# Altium schematic sheet AllPins_Peripherals.SchDoc
size A4; SheetNumber: 8; SheetTotal: 10
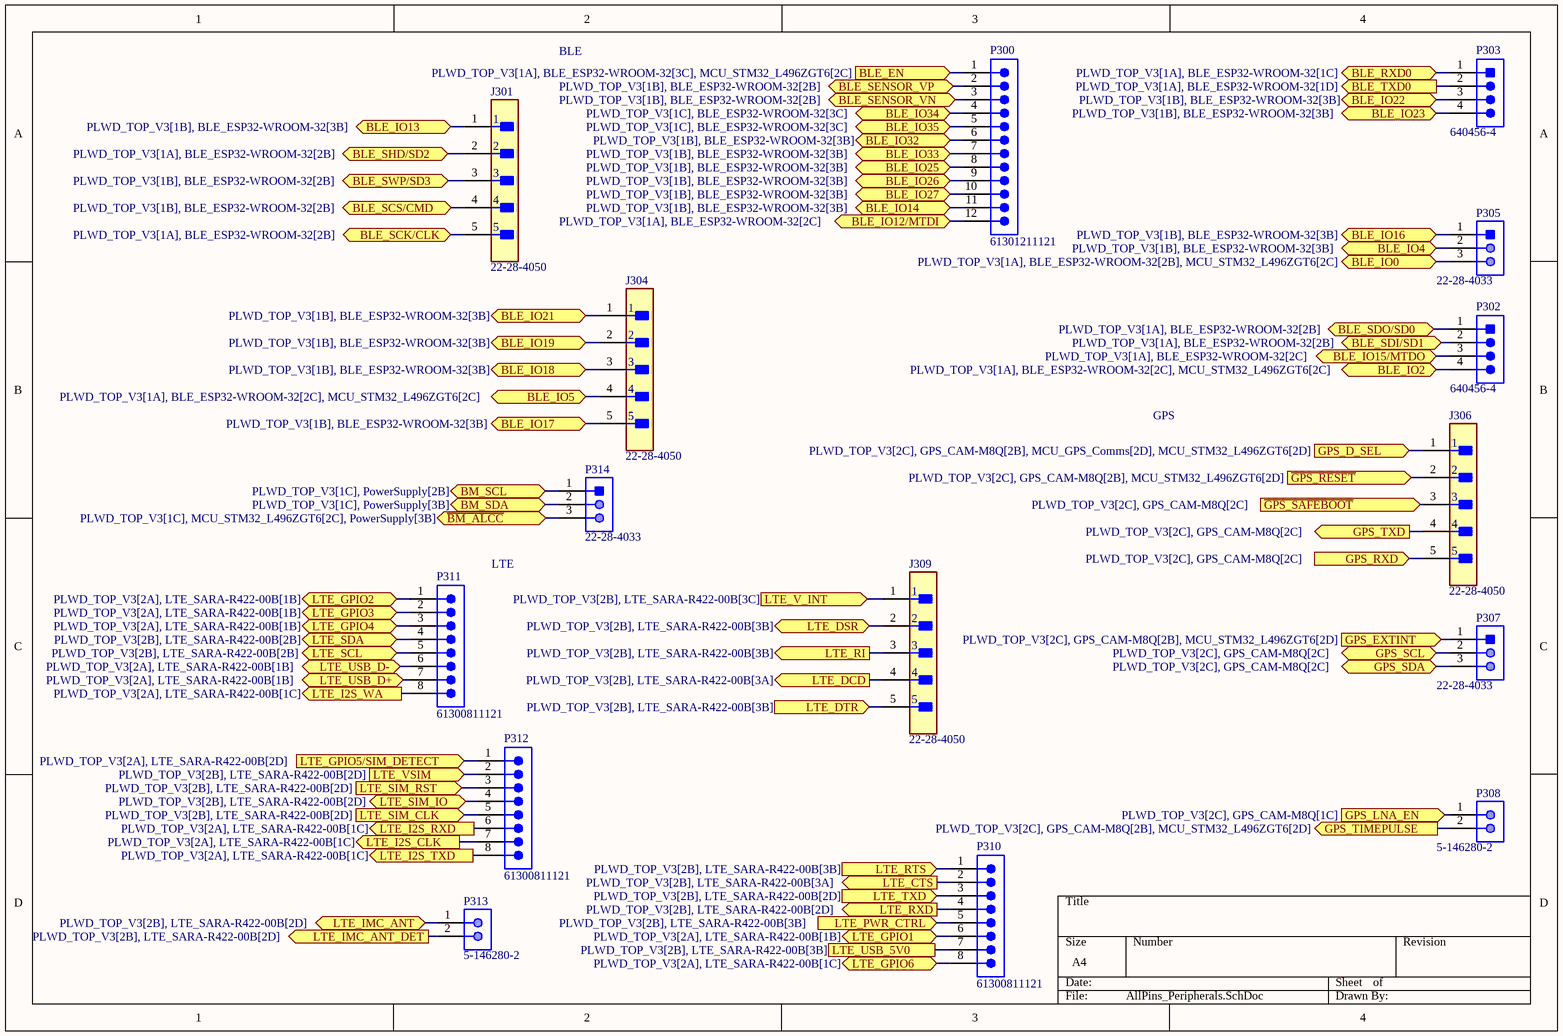
[diagram p0: AllPins_Peripherals.SchDoc]

## Parts
J301  22-28-4050  [FP-22-28-4050-MFG]
J304  22-28-4050  [FP-22-28-4050-MFG]
J306  22-28-4050  [FP-22-28-4050-MFG]
J309  22-28-4050  [FP-22-28-4050-MFG]
P300  61301211121  [61301211121]
P302  640456-4  [TECO-640456-4]
P303  640456-4  [TECO-640456-4]
P305  22-28-4033  [MOLX-22-28-4033_V]
P307  22-28-4033  [MOLX-22-28-4033_V]
P308  5-146280-2  [TECO-5-146280-2_V]
P310  61300811121  [61300811121]
P311  61300811121  [61300811121]
P312  61300811121  [61300811121]
P313  5-146280-2  [TECO-5-146280-2_V]
P314  22-28-4033  [MOLX-22-28-4033_V]

## Ports
BLE_EN (in, see PLWD_TOP_V3[1A], BLE_ESP32-WROOM-32[3C], MCU_STM32_L496ZGT6[2C]), BLE_IO0 (bidir, see PLWD_TOP_V3[1A], BLE_ESP32-WROOM-32[2B], MCU_STM32_L496ZGT6[2C]), BLE_IO2 (bidir, see PLWD_TOP_V3[1A], BLE_ESP32-WROOM-32[2C], MCU_STM32_L496ZGT6[2C]), BLE_IO4 (bidir, see PLWD_TOP_V3[1B], BLE_ESP32-WROOM-32[3B]), BLE_IO5 (bidir, see PLWD_TOP_V3[1A], BLE_ESP32-WROOM-32[2C], MCU_STM32_L496ZGT6[2C]), BLE_IO12/MTDI (bidir, see PLWD_TOP_V3[1A], BLE_ESP32-WROOM-32[2C]), BLE_IO13 (bidir, see PLWD_TOP_V3[1B], BLE_ESP32-WROOM-32[3B]), BLE_IO14 (bidir, see PLWD_TOP_V3[1B], BLE_ESP32-WROOM-32[3B]), BLE_IO15/MTDO (bidir, see PLWD_TOP_V3[1A], BLE_ESP32-WROOM-32[2C]), BLE_IO16 (bidir, see PLWD_TOP_V3[1B], BLE_ESP32-WROOM-32[3B]), BLE_IO17 (bidir, see PLWD_TOP_V3[1B], BLE_ESP32-WROOM-32[3B]), BLE_IO18 (bidir, see PLWD_TOP_V3[1B], BLE_ESP32-WROOM-32[3B]), BLE_IO19 (bidir, see PLWD_TOP_V3[1B], BLE_ESP32-WROOM-32[3B]), BLE_IO21 (bidir, see PLWD_TOP_V3[1B], BLE_ESP32-WROOM-32[3B]), BLE_IO22 (bidir, see PLWD_TOP_V3[1B], BLE_ESP32-WROOM-32[3B]), BLE_IO23 (bidir, see PLWD_TOP_V3[1B], BLE_ESP32-WROOM-32[3B]), BLE_IO25 (bidir, see PLWD_TOP_V3[1B], BLE_ESP32-WROOM-32[3B]), BLE_IO26 (bidir, see PLWD_TOP_V3[1B], BLE_ESP32-WROOM-32[3B]), BLE_IO27 (bidir, see PLWD_TOP_V3[1B], BLE_ESP32-WROOM-32[3B]), BLE_IO32 (bidir, see PLWD_TOP_V3[1B], BLE_ESP32-WROOM-32[3B]), BLE_IO33 (bidir, see PLWD_TOP_V3[1B], BLE_ESP32-WROOM-32[3B]), BLE_IO34 (bidir, see PLWD_TOP_V3[1C], BLE_ESP32-WROOM-32[3C]), BLE_IO35 (bidir, see PLWD_TOP_V3[1C], BLE_ESP32-WROOM-32[3C]), BLE_RXD0 (bidir, see PLWD_TOP_V3[1A], BLE_ESP32-WROOM-32[1C]), BLE_SCK/CLK (bidir, see PLWD_TOP_V3[1A], BLE_ESP32-WROOM-32[2B]), BLE_SCS/CMD (bidir, see PLWD_TOP_V3[1B], BLE_ESP32-WROOM-32[2B]), BLE_SDI/SD1 (bidir, see PLWD_TOP_V3[1A], BLE_ESP32-WROOM-32[2B]), BLE_SDO/SD0 (bidir, see PLWD_TOP_V3[1A], BLE_ESP32-WROOM-32[2B]), BLE_SENSOR_VN (bidir, see PLWD_TOP_V3[1B], BLE_ESP32-WROOM-32[2B]), BLE_SENSOR_VP (bidir, see PLWD_TOP_V3[1B], BLE_ESP32-WROOM-32[2B]), BLE_SHD/SD2 (bidir, see PLWD_TOP_V3[1A], BLE_ESP32-WROOM-32[2B]), BLE_SWP/SD3 (bidir, see PLWD_TOP_V3[1B], BLE_ESP32-WROOM-32[2B]), BLE_TXD0 (out, see PLWD_TOP_V3[1A], BLE_ESP32-WROOM-32[1D]), BM_SCL (bidir, see PLWD_TOP_V3[1C], PowerSupply[2B]), BM_SDA (bidir, see PLWD_TOP_V3[1C], PowerSupply[3B]), GPS_D_SEL (in, see PLWD_TOP_V3[2C], GPS_CAM-M8Q[2B], MCU_GPS_Comms[2D], MCU_STM32_L496ZGT6[2D]), GPS_EXTINT (in, see PLWD_TOP_V3[2C], GPS_CAM-M8Q[2B], MCU_STM32_L496ZGT6[2D]), GPS_LNA_EN (in, see PLWD_TOP_V3[2C], GPS_CAM-M8Q[1C]), GPS_RXD (in, see PLWD_TOP_V3[2C], GPS_CAM-M8Q[2C]), GPS_SCL (bidir, see PLWD_TOP_V3[2C], GPS_CAM-M8Q[2C]), GPS_SDA (bidir, see PLWD_TOP_V3[2C], GPS_CAM-M8Q[2C]), GPS_TIMEPULSE (out, see PLWD_TOP_V3[2C], GPS_CAM-M8Q[2B], MCU_STM32_L496ZGT6[2D]), GPS_TXD (out, see PLWD_TOP_V3[2C], GPS_CAM-M8Q[2C]), LTE_CTS (out, see PLWD_TOP_V3[2B], LTE_SARA-R422-00B[3A]), LTE_DCD (out, see PLWD_TOP_V3[2B], LTE_SARA-R422-00B[3A]), LTE_DSR (bidir, see PLWD_TOP_V3[2B], LTE_SARA-R422-00B[3B]), LTE_DTR (in, see PLWD_TOP_V3[2B], LTE_SARA-R422-00B[3B]), LTE_GPIO1 (bidir, see PLWD_TOP_V3[2A], LTE_SARA-R422-00B[1B]), LTE_GPIO2 (bidir, see PLWD_TOP_V3[2A], LTE_SARA-R422-00B[1B]), LTE_GPIO3 (bidir, see PLWD_TOP_V3[2A], LTE_SARA-R422-00B[1B]), LTE_GPIO4 (bidir, see PLWD_TOP_V3[2A], LTE_SARA-R422-00B[1B]), LTE_GPIO5/SIM_DETECT (in, see PLWD_TOP_V3[2A], LTE_SARA-R422-00B[2D]), LTE_GPIO6 (bidir, see PLWD_TOP_V3[2A], LTE_SARA-R422-00B[1C]), LTE_I2S_CLK (out, see PLWD_TOP_V3[2A], LTE_SARA-R422-00B[1C]), LTE_I2S_RXD (out, see PLWD_TOP_V3[2A], LTE_SARA-R422-00B[1C]), LTE_I2S_TXD (out, see PLWD_TOP_V3[2A], LTE_SARA-R422-00B[1C]), LTE_I2S_WA (out, see PLWD_TOP_V3[2A], LTE_SARA-R422-00B[1C]), LTE_IMC_ANT (bidir, see PLWD_TOP_V3[2B], LTE_SARA-R422-00B[2D]), LTE_IMC_ANT_DET (out, see PLWD_TOP_V3[2B], LTE_SARA-R422-00B[2D]), LTE_PWR_CTRL (in, see PLWD_TOP_V3[2B], LTE_SARA-R422-00B[3B]), LTE_RI (out, see PLWD_TOP_V3[2B], LTE_SARA-R422-00B[3B]), LTE_RTS (in, see PLWD_TOP_V3[2B], LTE_SARA-R422-00B[3B]), LTE_RXD (out, see PLWD_TOP_V3[2B], LTE_SARA-R422-00B[2D]), LTE_SCL (bidir, see PLWD_TOP_V3[2B], LTE_SARA-R422-00B[2B]), LTE_SDA (bidir, see PLWD_TOP_V3[2B], LTE_SARA-R422-00B[2B]), LTE_SIM_CLK (in, see PLWD_TOP_V3[2B], LTE_SARA-R422-00B[2D]), LTE_SIM_IO (bidir, see PLWD_TOP_V3[2B], LTE_SARA-R422-00B[2D]), LTE_SIM_RST (in, see PLWD_TOP_V3[2B], LTE_SARA-R422-00B[2D]), LTE_TXD (in, see PLWD_TOP_V3[2B], LTE_SARA-R422-00B[2D]), LTE_USB_5V0 (see PLWD_TOP_V3[2B], LTE_SARA-R422-00B[3B]), LTE_USB_D+ (bidir, see PLWD_TOP_V3[2A], LTE_SARA-R422-00B[1B]), LTE_USB_D- (bidir, see PLWD_TOP_V3[2A], LTE_SARA-R422-00B[1B]), LTE_V_INT (in, see PLWD_TOP_V3[2B], LTE_SARA-R422-00B[3C]), LTE_VSIM (in, see PLWD_TOP_V3[2B], LTE_SARA-R422-00B[2D]), ~{BM_ALCC} (bidir, see PLWD_TOP_V3[1C], MCU_STM32_L496ZGT6[2C], PowerSupply[3B]), ~{GPS_RESET} (in, see PLWD_TOP_V3[2C], GPS_CAM-M8Q[2B], MCU_STM32_L496ZGT6[2D]), ~{GPS_SAFEBOOT} (in, see PLWD_TOP_V3[2C], GPS_CAM-M8Q[2C])

## Nets
~{BM_ALCC}: P314.3 ; port ~{BM_ALCC}
BLE_EN: P300.1 ; port BLE_EN
BLE_IO0: P305.3 ; port BLE_IO0
BLE_IO2: P302.4 ; port BLE_IO2
BLE_IO4: P305.2 ; port BLE_IO4
BLE_IO5: J304.4 ; port BLE_IO5
BLE_IO12/MTDI: P300.12 ; port BLE_IO12/MTDI
BLE_IO13: J301.1 ; port BLE_IO13
BLE_IO14: P300.11 ; port BLE_IO14
BLE_IO15/MTDO: P302.3 ; port BLE_IO15/MTDO
BLE_IO16: P305.1 ; port BLE_IO16
BLE_IO17: J304.5 ; port BLE_IO17
BLE_IO18: J304.3 ; port BLE_IO18
BLE_IO19: J304.2 ; port BLE_IO19
BLE_IO21: J304.1 ; port BLE_IO21
BLE_IO22: P303.3 ; port BLE_IO22
BLE_IO23: P303.4 ; port BLE_IO23
BLE_IO25: P300.8 ; port BLE_IO25
BLE_IO26: P300.9 ; port BLE_IO26
BLE_IO27: P300.10 ; port BLE_IO27
BLE_IO32: P300.6 ; port BLE_IO32
BLE_IO33: P300.7 ; port BLE_IO33
BLE_IO34: P300.4 ; port BLE_IO34
BLE_IO35: P300.5 ; port BLE_IO35
BLE_RXD0: P303.1 ; port BLE_RXD0
BLE_SCK/CLK: J301.5 ; port BLE_SCK/CLK
BLE_SCS/CMD: J301.4 ; port BLE_SCS/CMD
BLE_SDI/SD1: P302.2 ; port BLE_SDI/SD1
BLE_SDO/SD0: P302.1 ; port BLE_SDO/SD0
BLE_SENSOR_VN: P300.3 ; port BLE_SENSOR_VN
BLE_SENSOR_VP: P300.2 ; port BLE_SENSOR_VP
BLE_SHD/SD2: J301.2 ; port BLE_SHD/SD2
BLE_SWP/SD3: J301.3 ; port BLE_SWP/SD3
BLE_TXD0: P303.2 ; port BLE_TXD0
BM_SCL: P314.1 ; port BM_SCL
BM_SDA: P314.2 ; port BM_SDA
~{GPS_RESET}: J306.2 ; port ~{GPS_RESET}
~{GPS_SAFEBOOT}: J306.3 ; port ~{GPS_SAFEBOOT}
GPS_D_SEL: J306.1 ; port GPS_D_SEL
GPS_EXTINT: P307.1 ; port GPS_EXTINT
GPS_LNA_EN: P308.1 ; port GPS_LNA_EN
GPS_RXD: J306.5 ; port GPS_RXD
GPS_SCL: P307.2 ; port GPS_SCL
GPS_SDA: P307.3 ; port GPS_SDA
GPS_TIMEPULSE: P308.2 ; port GPS_TIMEPULSE
GPS_TXD: J306.4 ; port GPS_TXD
LTE_CTS: P310.2 ; port LTE_CTS
LTE_DCD: J309.4 ; port LTE_DCD
LTE_DSR: J309.2 ; port LTE_DSR
LTE_DTR: J309.5 ; port LTE_DTR
LTE_GPIO1: P310.6 ; port LTE_GPIO1
LTE_GPIO2: P311.1 ; port LTE_GPIO2
LTE_GPIO3: P311.2 ; port LTE_GPIO3
LTE_GPIO4: P311.3 ; port LTE_GPIO4
LTE_GPIO5/SIM_DETECT: P312.1 ; port LTE_GPIO5/SIM_DETECT
LTE_GPIO6: P310.8 ; port LTE_GPIO6
LTE_I2S_CLK: P312.7 ; port LTE_I2S_CLK
LTE_I2S_RXD: P312.6 ; port LTE_I2S_RXD
LTE_I2S_TXD: P312.8 ; port LTE_I2S_TXD
LTE_I2S_WA: P311.8 ; port LTE_I2S_WA
LTE_IMC_ANT: P313.1 ; port LTE_IMC_ANT
LTE_IMC_ANT_DET: P313.2 ; port LTE_IMC_ANT_DET
LTE_PWR_CTRL: P310.5 ; port LTE_PWR_CTRL
LTE_RI: J309.3 ; port LTE_RI
LTE_RTS: P310.1 ; port LTE_RTS
LTE_RXD: P310.4 ; port LTE_RXD
LTE_SCL: P311.5 ; port LTE_SCL
LTE_SDA: P311.4 ; port LTE_SDA
LTE_SIM_CLK: P312.5 ; port LTE_SIM_CLK
LTE_SIM_IO: P312.4 ; port LTE_SIM_IO
LTE_SIM_RST: P312.3 ; port LTE_SIM_RST
LTE_TXD: P310.3 ; port LTE_TXD
LTE_USB_5V0: P310.7 ; port LTE_USB_5V0
LTE_USB_D+: P311.7 ; port LTE_USB_D+
LTE_USB_D-: P311.6 ; port LTE_USB_D-
LTE_V_INT: J309.1 ; port LTE_V_INT
LTE_VSIM: P312.2 ; port LTE_VSIM

## Notes on the sheet
- BLE
- GPS
- LTE

## Library data of the parts
J301 J304 J306 J309 = CMP-00257-00278173-1: 22-28-4050 KK® 254 Breakaway Header, Vertical, 5 Circuits, Tin (Sn) Plating, Mating Pin Length 6.09mm; NexarPartId: 278173; Voltage Rating: 250V; Number of Contacts: 5; Contact Resistance: 20mΩ; Gender: Male; Pitch: 2.54mm; Connector Type: Male Pin; Current Rating: 4A; Glow Wire Compliant: Non-compliant; Max Voltage Rating (DC): 250.25kV; Flammability Rating: UL94 V-0; Min Operating Temperature: 0°C; REACH SVHC: Unknown; Lead Free: Lead Free; Termination: Solder; RoHS: Compliant; Schedule B: 8536694040; Number of Circuits: 5; Mount: Through Hole; Lead Pitch: 2.54mm; Height: 2.29mm; Voltage Rating (DC): 250V; Max Operating Temperature: 75°C; Width: 2.49mm; Radiation Hardening: No; Contact Plating: Tin; Orientation: Vertical; Length: 12.7mm; Number of Rows: 1; Housing Material: Thermoplastic; Contact Material: Brass; Packaging: Bulk; Contact Mating Length: 6.096mm; Housing Color: Black; Color: Black; Number of Positions: 5
P300 = CMP-1502-01086-2: NexarPartId: 32855538; Gender: Male; Pitch: 2.54mm; Contact Resistance: 20mΩ; Number of Positions: 12; Current Rating: 3A; Connector Type: Male Pin; Operating Supply Voltage: 250V; Contact Material: Copper; Contact Plating: Gold; Color: Black; REACH SVHC: Unknown; Termination: Solder; Number of Contacts: 12; RoHS: Compliant; Lead Pitch: 2.54mm; Orientation: Vertical; Contact Mating Length: 5.9944mm; Mount: Through Hole; Number of Pins: 12; Packaging: Bulk; Number of Rows: 1
P302 P303 = CMP-2000-05419-1: Male Header, Pitch 2.54 mm, 1 x 4 Position, Height 10.03 mm, Tail Length 3.56 mm, RoHS, Bulk; Manufacturer: TE Connectivity; Material, Housing: Polyester; Primary Type: InterconnectSystem; Mount Angle: Vertical; Color, Housing: White; Current, Rating: 5 / A; Agency Approvals: CSA,UL; Contact Termination Area Plating: Tin; Temperature, Operating: -55to+105 / degC; Standards: RoHSCompliant,ELVCompliant,UL94V-0; Number of Positions: 4; Brand/Series: MTA-100Series; Angle: Straight; Pin Spacing: 0.1 / "; Material, Contact: CopperAlloy; Connector Type: MTA-100; Special Features: Pinstrip; Mounting Hole Size: 0.04 / "; Contact Centerline Spacing: 0.100 / in.; Voltage, Rating: 250 / V; Manufacturer URL: http://www.te.com/; Length, Pin: 0.14 / "; Length, Overall: 0.4 / "; Color: White; Flammability Rating: UL94V-0; Mounting Type: PCMount; Termination: Solder; Datasheet URL: https://datasheet.ciiva.com/16286/eng-ds-82056-mta-0608-16286228.pdf; Number of Contacts: 4; Contact Shape: Square; Contact Mating Area Plating: Tin; Length, Terminal Post: 0.14 / in.; Size, Post: 0.025 / in.; Contact Plating: Tin; Type: PCBPlug; Datasheet Version: Dec-14; Number of Rows: 1
P305 P307 P314 = CMP-1676-00001-5: Male Header, Pitch 2.54 mm, 1 x 3 Position, Height 8.38 mm, Tail Length 3.18 mm, RoHS, Bulk; Manufacturer: Molex; Rows: 1; Voltage Rating: 250 V; Current Rating: 4 A; Min Operating Temperature: 0 degC; Lead Pitch: 0.1 inch; Packaging: Bulk; Contact Finish: Gold; RoHSCompliant: true; Contact Material: Brass; PackageReference: 22-28-4033; REACH SVHC: Unknown; PackageDescription: Male Header, Pitch 2.54 mm, 1 x 3 Position, Height 8.38 mm, Tail Length 3.18 mm; ComponentLink2URL: http://www.molex.com/pdm_docs/sd/022284033_sd.pdf; Height: 8.38 mm; Mounting Technology: Through Hole; ComponentLink1Description: Manufacturer URL; Length: 7.62 mm; Mount: Through Hole; DatasheetVersion: Rev. G, 01/2012; Max Operating Temperature: 75 degC; ComponentLink2Description: Datasheet; Colour: Black; Pins: 3; Contact Plating: Gold; Package Quantity: 1; ComponentLink1URL: http://www.molex.com/
P308 P313 = CMP-2000-07492-1: Male Header, Pitch 2.54 mm, 1 x 2 Position, Height 8.21 mm, Tail Length 3.05 mm, -65 to 105 degC, RoHS, Bulk; Manufacturer: TE Connectivity; Mating Connector Lock: No(Without); Number of Positions: 2; Pitch: 2.54mm; PCB Mounting Orientation: Vertical; Keyed: No; Case\/Package: 100; Mating Post Length: 0.23inch; High Temperature Housing: Yes; Max Current Rating: 5A; PCB Thickness: 0.063inch; PCB Mount Retention: Without; Approvals: CSA; Current Rating: 3A; Radiation Hardening: No; Length: 4.67mm; Contact Mating Length: 0.23inch; Connector Type: Header; Number of Rows: 1; Termination Post Length: 0.12inch; Board Standoff: No(Without); Max Operating Temperature: 105degC; Contact Shape: Square; Selectively Loaded: No(Without); Gasket: No(Without); Number of Contacts: 2; Contact Gender: Male; Mating Alignment: No(Without); Manufacturer URL: http://www.te.com/; Datasheet URL: http://www.te.com/commerce/DocumentDelivery/DDEController?Action=showdoc&DocId=Customer+Drawing%7F146280%7FH1%7Fpdf%7FEnglish%7FENG_CD_146280_H1.pdf%7F5-146280-2; Mount: ThroughHole; Orientation: Straight; Packaging: Carton; Package Reference: 5-146280-2; Package Quantity: 500; Stabilizers: No(Without); Row Spacing: 2.54mm; Contact Material: CopperAlloy; Panel Mount Retention: No(Without); Datasheet Version: Rev. H1, 08/2016; Housing Colour: Black; Colour: Black; Package Description: Male Header, Pitch 2.54 mm, 1 x 2 Position, Height 8.21 mm, Tail Length 3.05 mm; Contact Plating: Matte; Housing Material: Polymer; Contact Protection: No(Without); Min Operating Temperature: -65degC; Mounting Technology: ThroughHole; Flammability Rating: UL94V-0; RoHSCompliant: true; Termination: ThroughHole; Depth: 2.34mm; High Speed Serial Data Connector: No
P310-P312 = CMP-1502-01076-2: NexarPartId: 32855533; Current Rating: 3A; Connector Type: Male Pin; Voltage Rating: 250V; Number of Contacts: 8; Pitch: 2.54mm; Contact Resistance: 20mΩ; Gender: Male; REACH SVHC: Unknown; Number of Rows: 1; Mount: Through Hole; Termination: Solder; Number of Pins: 8; Number of Positions: 8; Height: 8.54mm; Contact Mating Length: 5.9944mm; Orientation: Vertical; Operating Supply Voltage: 250V; Min Operating Temperature: -40°C; Max Operating Temperature: 105°C; Packaging: Bulk; Color: Black; Lead Pitch: 2.54mm; RoHS: Compliant; Contact Material: Copper; Contact Plating: Gold